# EAGLE design lcd_carrier (EAGLE 7.0.0)
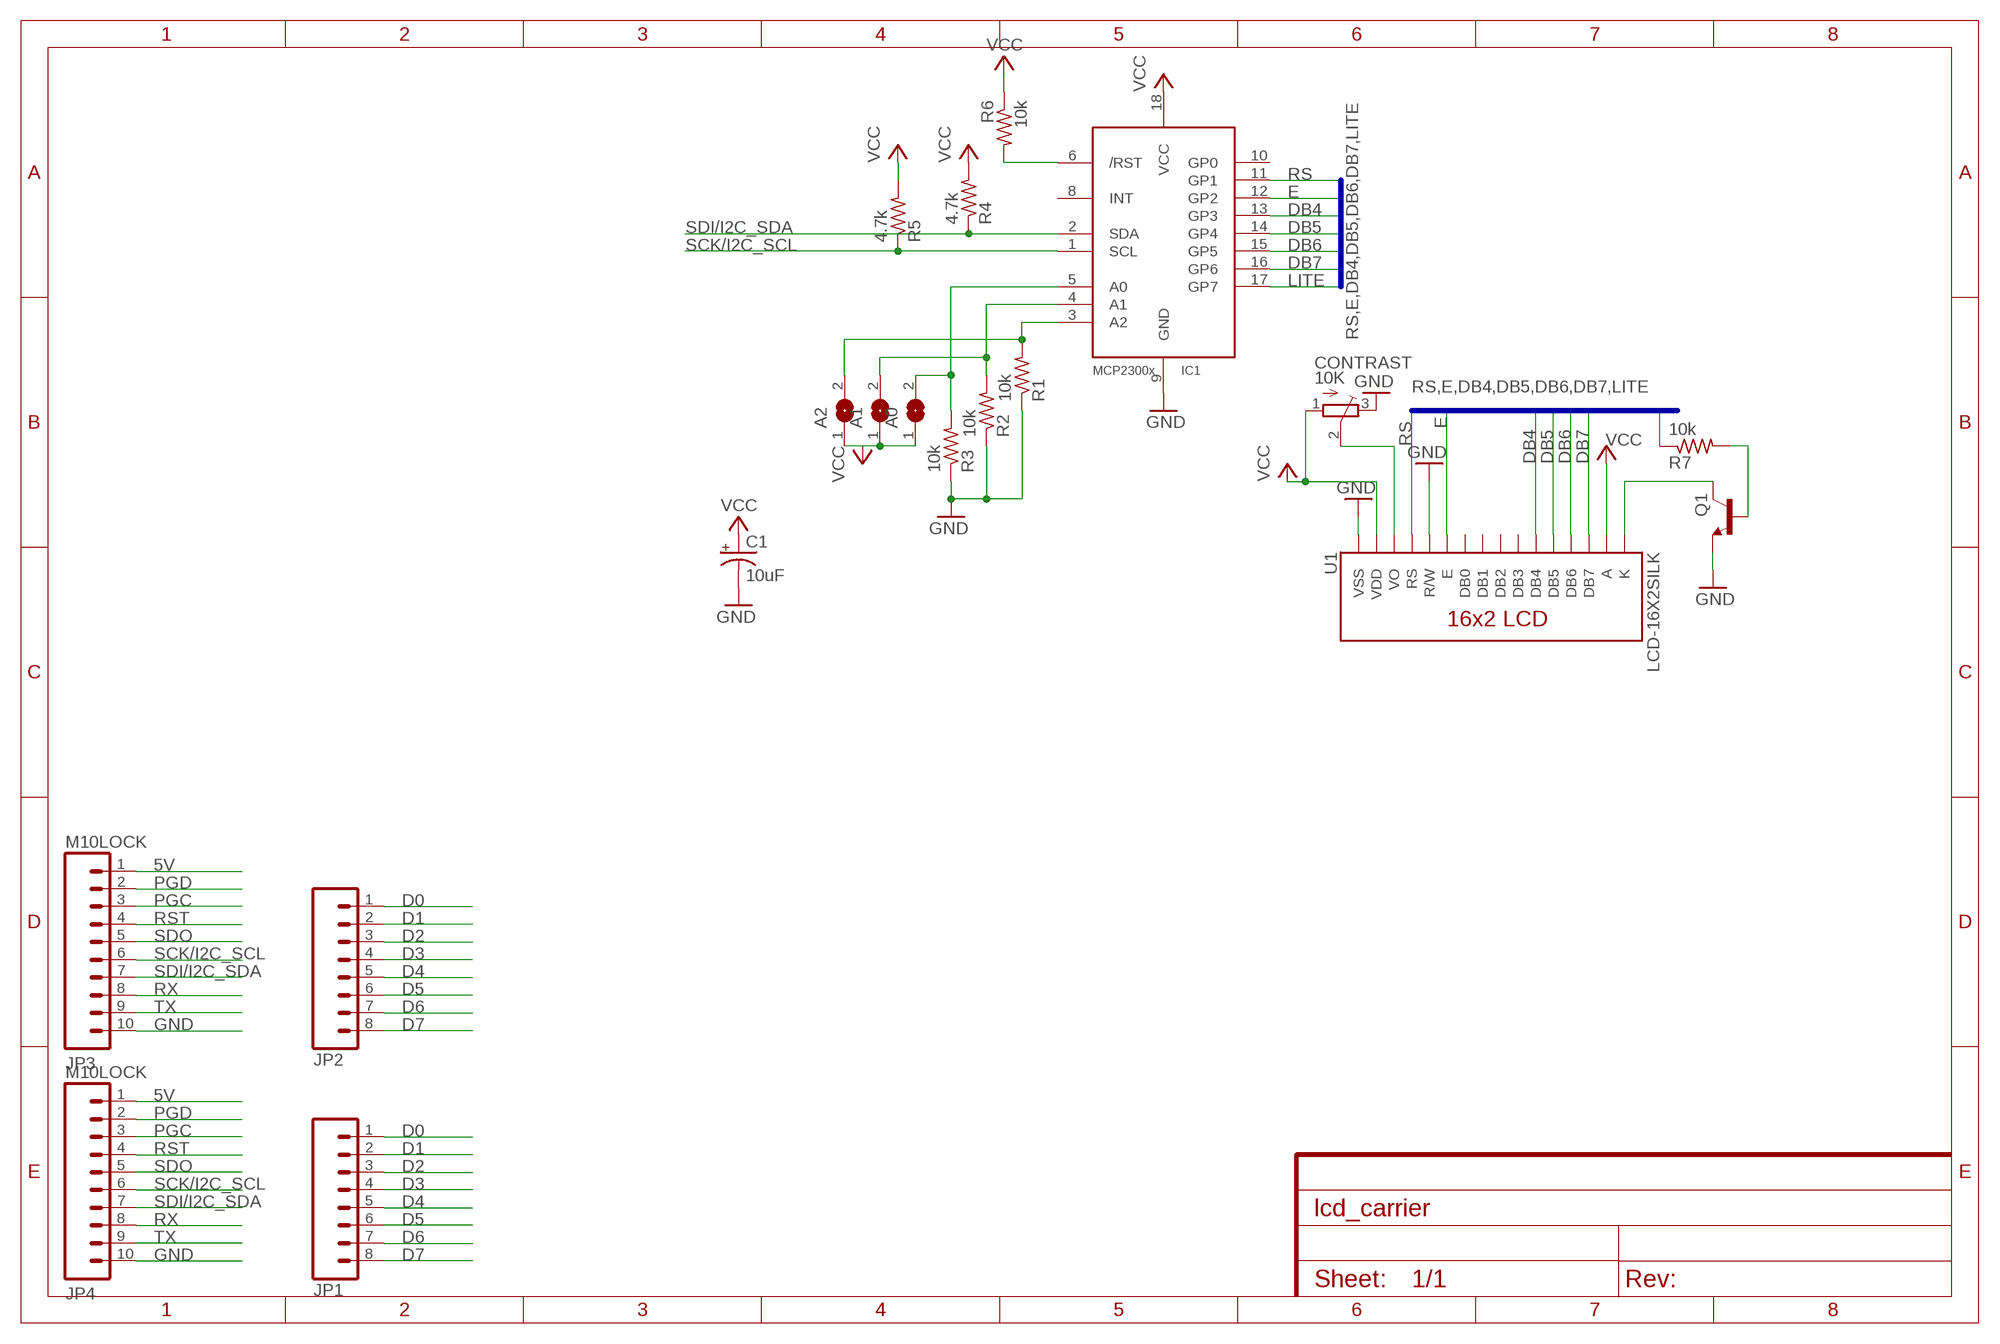
[diagram p0: schematic, sheet 1]

## Parts
A0  SJ  [SJ]
A1  SJ  [SJ]
A2  SJ  [SJ]
C1  10uF  CPOL-USA/3216-18R  [A/3216-18R]
CONTRAST  10K  TRIMPOTTC33X  [TC33X]
IC1  MCP2300X/SO  [SO18W]
JP1  M08LOCK  [1X08_LOCK]
JP2  M08LOCK  [1X08_LOCK]
JP3  M10LOCK  [1X10_LOCK]
JP4  M10LOCK  [1X10_LOCK]
Q1  MMBT2222ALT1-NPN-SOT23-BEC  [SOT23-BEC]
R1  10k  R-US_R0805  [R0805]
R2  10k  R-US_R0805  [R0805]
R3  10k  R-US_R0805  [R0805]
R4  4.7k  R-US_R0805  [R0805]
R5  4.7k  R-US_R0805  [R0805]
R6  10k  R-US_R0805  [R0805]
R7  10k  R-US_R0805  [R0805]
U1  LCD-16X2SILK  [LCD-16X2]

## Nets
5V: JP3.1 JP4.1
D0: JP1.1 JP2.1
D1: JP1.2 JP2.2
D2: JP1.3 JP2.3
D3: JP1.4 JP2.4
D4: JP1.5 JP2.5
D5: JP1.6 JP2.6
D6: JP1.7 JP2.7
D7: JP1.8 JP2.8
DB4: IC1.13(GP3) U1.11(DB4)
DB5: IC1.14(GP4) U1.12(DB5)
DB6: IC1.15(GP5) U1.13(DB6)
DB7: IC1.16(GP6) U1.14(DB7)
E: IC1.12(GP2) U1.6(E)
GND: C1.- CONTRAST.3(E) IC1.9(GND) JP3.10 JP4.10 Q1.E R1.1 R2.1 R3.1 U1.1(VSS) U1.5(R/W)
LITE: IC1.17(GP7) R7.1
N$1: A0.2 IC1.5(A0) R3.2
N$2: IC1.6(/RST) R6.2
N$3: A1.2 IC1.4(A1) R2.2
N$7: A2.2 IC1.3(A2) R1.2
N$9: Q1.C U1.16(K)
N$10: Q1.B R7.2
N$11: CONTRAST.2(S) U1.3(VO)
PGC: JP3.3 JP4.3
PGD: JP3.2 JP4.2
RS: IC1.11(GP1) U1.4(RS)
RST: JP3.4 JP4.4
RX: JP3.8 JP4.8
SCK/I2C_SCL: IC1.1(SCL) JP3.6 JP4.6 R5.1
SDI/I2C_SDA: IC1.2(SDA) JP3.7 JP4.7 R4.1
SDO: JP3.5 JP4.5
TX: JP3.9 JP4.9
VCC: A0.1 A1.1 A2.1 C1.+ CONTRAST.1(A) IC1.18(VCC) R4.2 R5.2 R6.1 U1.2(VDD) U1.15(A)
Unconnected: IC1.8(INT) IC1.10(GP0) U1.7(DB0) U1.8(DB1) U1.9(DB2) U1.10(DB3)

## Buses
RS,E,DB4,DB5,DB6,DB7,LITE

## Library data of the parts
A0 A1 A2 = jumper:SJ: SMD solder JUMPER
C1 = adafruit:CPOL-US: POLARIZED CAPACITOR, American symbol
CONTRAST = adafruit:TRIMPOT: SMT trimmer potentiometer part number TC33X http://www.ladyada.net/library/eagle
IC1 = adafruit:MCP2300X: MCP23008 Inexpensive i2c i/o expander - 8 general purpose i/o pins with optional pullups
JP1 JP2 = SparkFun-Connectors:M08: Header 8 Standard 8-pin 0.1" header. Use with straight break away headers (SKU : PRT-00116), right angle break away headers (PRT-00553), swiss pins (PRT-00743), machine pins (PRT-00117), and female headers (PRT-00115).
JP3 JP4 = SparkFun-Connectors:M10: Header 10 Standard 10-pin 0.1" header. Use with straight break away headers (SKU : PRT-00116), right angle break away headers (PRT-00553), swiss pins (PRT-00743), machine pins (PRT-00117), and female headers (PRT-00115).
Q1 = transistor:*-NPN-: NPN Transistror BF959 corrected 2008.03.06
R1-R7 = adafruit:R-US_: RESISTOR, American symbol
U1 = SparkFun-Displays:LCD-16X2: Standard text-only 16x2 parallel input LCD

## Board
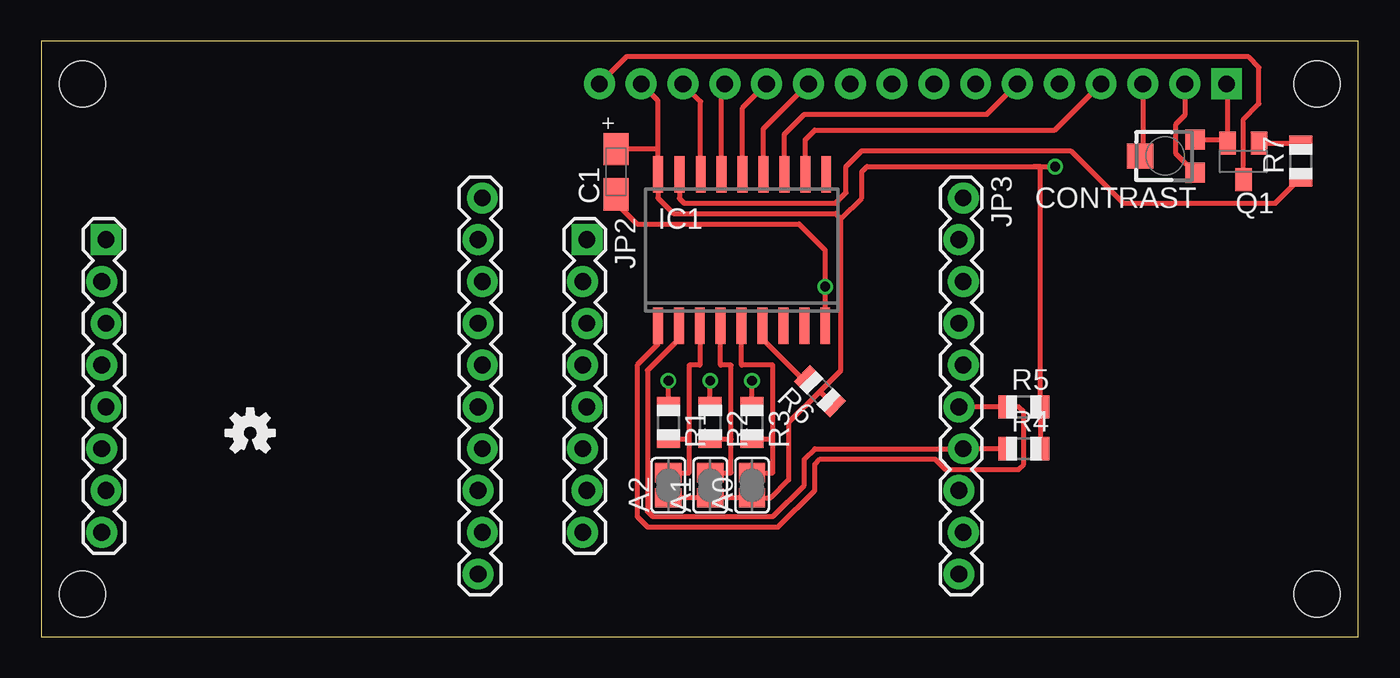
[diagram p1: board, top side]
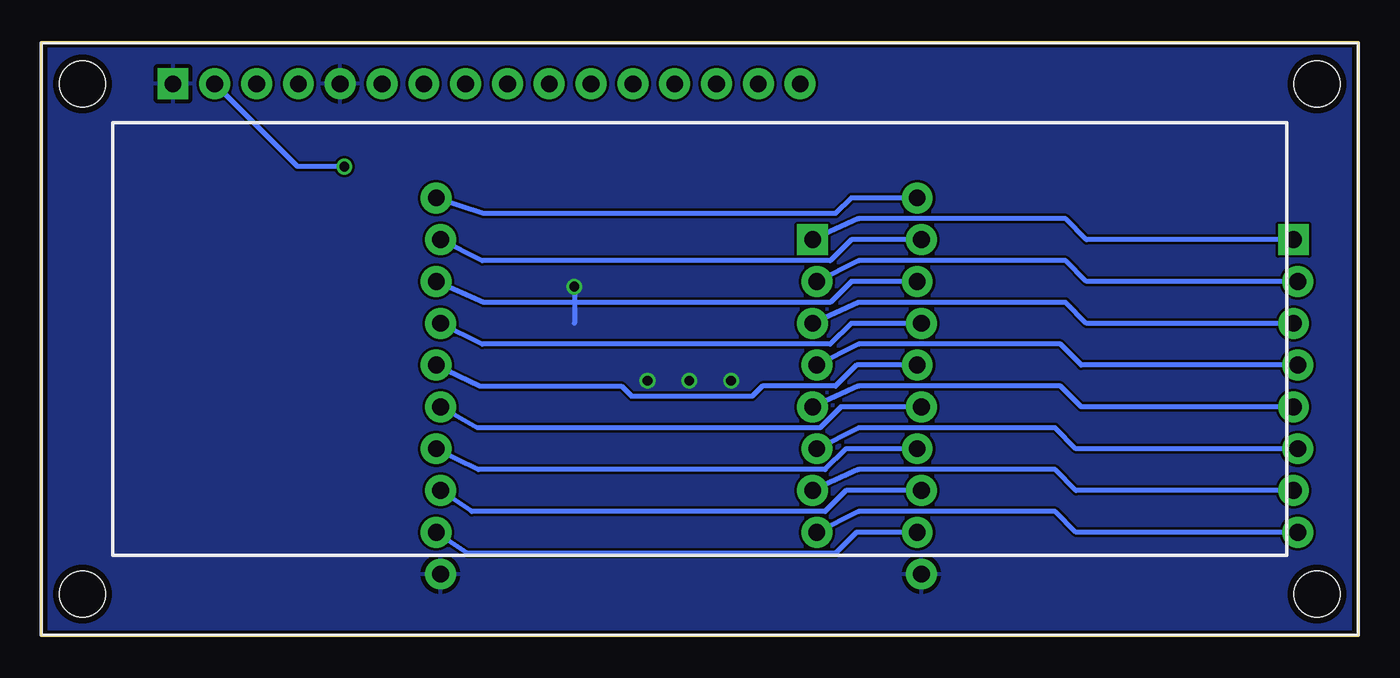
[diagram p2: board, bottom side, seen from below]

Size 80.01 x 36.2 mm. Coordinates in mm from the lower left corner, seen from the top.
Outline: 0,0 80.01,0 80.01,36.2 0,36.2 0,0
Copper layers (1*16): Top 0.0356mm / dielectric 1.5011mm / Bottom 0.0356mm
Design rules "LaenPCBOrder": minimum track width 6mil, minimum drill 13mil, track to track 6mil, track to pad 6mil, pad to pad 6mil, via to via 6mil, smd to smd 6mil, copper to edge 15mil, drill to drill 6mil, minimum pad ring 7mil, minimum via ring 7mil, stop-mask expansion 3mil, vias tented up to drill 0mil, thermal gap 10mil

### Footprints (pad centres in the part's own frame; a part is rotated, then mirrored left to right if it is on the bottom)
SJ = smd 1.168 x 1.6: 1 -0.762,0; 2 0.762,0
A/3216-18R = smd 1.95 x 1.5: + 1.375,0; - -1.375,0
TC33X = smd 1.2 x 1.2: 1 -1,-1.825; 3 1,-1.825 | smd 1.5 x 1.6: 2 0,1.5
SO18W = smd 0.6 x 2.2: 1 -4.445,-4.6; 2 -3.175,-4.6; 3 -1.905,-4.6; 4 -0.635,-4.6; 5 0.635,-4.6; 6 1.905,-4.6; 7 3.175,-4.6; 8 4.445,-4.6; 9 5.715,-4.6; 10 5.775,4.6; 11 4.505,4.6; 12 3.235,4.6; 13 1.965,4.6; 14 0.695,4.6; 15 -0.575,4.6; 16 -1.845,4.6; 17 -3.145,4.6; 18 -4.445,4.6
1X08_LOCK = drill 1.016 pad 1.88 square: 1 0,0.127 | drill 1.016 pad 1.88: 2 2.54,-0.127; 3 5.08,0.127; 4 7.62,-0.127; 5 10.16,0.127; 6 12.7,-0.127; 7 15.24,0.127; 8 17.78,-0.127
1X10_LOCK = drill 1.016 pad 1.88: 1 0,0.127; 2 2.54,-0.127; 3 5.08,0.127; 4 7.62,-0.127; 5 10.16,0.127; 6 12.7,-0.127; 7 15.24,0.127; 8 17.78,-0.127; 9 20.32,0.127; 10 22.86,-0.127
SOT23-BEC = smd 1 x 1.4: B -0.95,-1.1; C 0,1.1; E 0.95,-1.1
R0805 = smd 1.1 x 1.4: 1 -1,0; 2 1,0
LCD-16X2 = drill 1.016 pad 1.88 square: 1 -32,15.5 | drill 1.016 pad 1.88: 2 -29.46,15.5; 3 -26.92,15.5; 4 -24.38,15.5; 5 -21.84,15.5; 6 -19.3,15.5; 7 -16.76,15.5; 8 -14.22,15.5; 9 -11.68,15.5; 10 -9.14,15.5; 11 -6.6,15.5; 12 -4.06,15.5; 13 -1.52,15.5; 14 1.02,15.5; 15 3.56,15.5; 16 6.1,15.5 | hole 2.8: -37.5,15.5; -37.5,-15.5; 37.5,15.5; 37.5,-15.5

### Placement (x,y rotation side)
A0  43.18,9.21 90 top
A1  40.64,9.21 90 top
A2  38.1,9.21 90 top
C1  34.92,28.26 90 top
CONTRAST  68.26,29.21 90 top
IC1  41.91,23.5 0 top
JP1  3.81,24.13 270 top
JP2  33.02,24.13 270 top
JP3  55.88,26.67 270 top
JP4  26.67,26.67 270 top
Q1  73.03,28.89 180 top
R1  38.1,13.02 270 top
R2  40.64,13.02 270 top
R3  43.18,13.02 270 top
R4  59.69,11.43 0 top
R5  59.69,13.97 0 top
R6  47.31,14.92 135 top
R7  76.52,28.89 90 top
U1  40.01,18.1 0 bottom
U$1  [OSHW-LOGO-S]  12.7,12.38 0 top

### Tracks (layer width: path | path; a pad name or v marks a point on that pad's centre or on a via)
5V
  Bottom 0.305: JP4.1 30.8,26.67 31.75,25.72 53.15,25.72 JP3.1
D0
  Bottom 0.305: JP1.1 16.51,24.13 17.78,25.4 30.35,25.4 JP2.1
D1
  Bottom 0.305: JP1.2 16.51,21.59 17.78,22.86 30.35,22.86 JP2.2
D2
  Bottom 0.305: JP1.3 16.51,19.05 17.78,20.32 30.35,20.32 JP2.3
D3
  Bottom 0.305: JP1.4 16.83,16.51 18.1,17.78 30.35,17.78 JP2.4
D4
  Bottom 0.305: JP1.5 16.83,13.97 18.1,15.24 30.35,15.24 JP2.5
D5
  Bottom 0.305: JP1.6 17.14,11.43 18.41,12.7 30.35,12.7 JP2.6
D6
  Bottom 0.305: JP1.7 17.14,8.89 18.41,10.16 30.35,10.16 JP2.7
D7
  Bottom 0.305: JP1.8 17.14,6.35 18.41,7.62 30.35,7.62 JP2.8
DB4
  Top 0.305: IC1.13 43.88,30.87 U1.11
DB5
  Top 0.305: IC1.14 42.6,32.14 U1.12
DB6
  Top 0.305: IC1.15 41.34,33.41 U1.13
DB7
  Top 0.305: IC1.16 40.06,32.52 U1.14
E
  Top 0.305: IC1.12 45.15,30.54 46.35,31.75 57.46,31.75 U1.6
GND  (via drill 0.6)
  Top 0.305: U1.1 72.08,33.53 Q1.E 71.86,30.21 CONTRAST.3 | C1.- 34.92,26.35 36.2,25.08 46.04,25.08 47.62,23.5 v47.62,21.27 IC1.9 | R1.1 v38.1,15.56 | R2.1 v40.64,15.56 | R3.1 v43.18,15.56
  Bottom 0.305: v38.1,15.56 38.1,15.88 | v40.64,15.56 40.64,15.88 | v43.18,15.56 43.18,15.88 | v47.62,21.27 47.62,19.05
  pour Bottom: 0,36.2 80.01,36.2 80.01,0 0,0
LITE
  Top 0.305: R7.1 74.98,26.35 65.72,26.35 62.55,29.53 49.85,29.53 48.9,28.57 48.9,26.99 48.26,26.35 39.05,26.35 38.77,26.64 IC1.17
N$1
  Top 0.305: R3.2 44.45,12.02 | 44.45,12.02 44.45,16.51 42.55,16.51 IC1.5 | A0.2 44.45,9.97 44.45,12.02
N$2
  Top 0.305: R6.2 46.28,15.63 43.81,18.1 IC1.6
N$3
  Top 0.305: R2.2 41.91,12.02 | 41.91,12.02 41.91,16.51 41.27,16.51 IC1.4 | A1.2 41.91,9.97 41.91,12.02
N$7
  Top 0.305: IC1.3 40.01,16.51 39.37,16.51 39.37,12.02 | R1.2 39.37,12.02 | A2.2 39.37,9.97 39.37,12.02
N$9
  Top 0.305: Q1.C 73.03,31.43 73.98,32.38 73.98,34.61 73.34,35.24 35.55,35.24 U1.16
N$10
  Top 0.305: Q1.B 76.42,29.99 R7.2
N$11
  Top 0.305: U1.3 66.92,29.37 CONTRAST.2
PGC
  Bottom 0.305: JP4.3 30.8,21.59 32.07,20.32 53.15,20.32 JP3.3
PGD
  Bottom 0.305: JP4.2 30.8,24.13 32.07,22.86 53.21,22.86 JP3.2
RS
  Top 0.305: IC1.11 46.41,30.22 46.99,30.8 61.59,30.8 U1.4
RST
  Bottom 0.305: JP4.4 30.8,19.05 32.07,17.78 53.21,17.78 JP3.4
RX
  Bottom 0.305: JP4.8 31.11,8.89 32.38,7.62 53.85,7.62 JP3.8
SCK/I2C_SCL
  Top 0.305: JP3.6 R5.1 59.37,13.97 59.69,13.65 59.69,10.48 59.37,10.16 54.93,10.16 54.29,10.79 47.31,10.79 46.99,10.48 46.99,8.89 44.77,6.67 36.83,6.67 36.2,7.3 36.2,16.51 37.47,17.78 IC1.1
  Bottom 0.305: JP4.6 31.43,13.97 32.7,12.7 53.53,12.7 JP3.6
SDI/I2C_SDA
  Top 0.305: R4.1 JP3.7 46.99,11.43 46.35,10.79 46.35,9.21 44.45,7.3 37.15,7.3 36.83,7.62 36.83,16.19 38.73,18.1 IC1.2
  Bottom 0.305: JP4.7 31.11,11.43 32.38,10.16 53.47,10.16 JP3.7
SDO
  Bottom 0.305: JP4.5 30.48,16.51 31.75,15.24 36.2,15.24 36.83,14.61 44.13,14.61 44.77,15.24 53.34,15.24 JP3.5
TX
  Bottom 0.305: JP4.9 30.48,6.35 31.75,5.08 54.1,5.08 JP3.9
VCC  (via drill 0.6)
  Top 0.305: A2.1 A1.1 A0.1 44.32,8.45 45.4,9.53 45.4,13.02 47.31,14.92 | IC1.18 37.47,32.58 U1.15 | U1.2 69.47,31.68 68.9,31.11 68.9,29.4 CONTRAST.1 | IC1.18 37.47,26.67 38.42,25.72 48.26,25.72 48.58,25.4 | IC1.18 37.47,29.63 C1.+ | 47.31,14.92 48.58,16.19 48.58,25.4 | 48.58,25.4 49.85,26.67 49.85,28.26 50.16,28.57 60.33,28.57 | 60.33,28.57 v61.59,28.57 | R6.1 | R6.1 47.31,14.92 | R4.2 R5.2 60.69,28.57 60.33,28.57
  Bottom 0.305: v61.59,28.57 64.44,28.57 U1.2